# EAGLE schematic TA7642-AM (EAGLE 5.07)
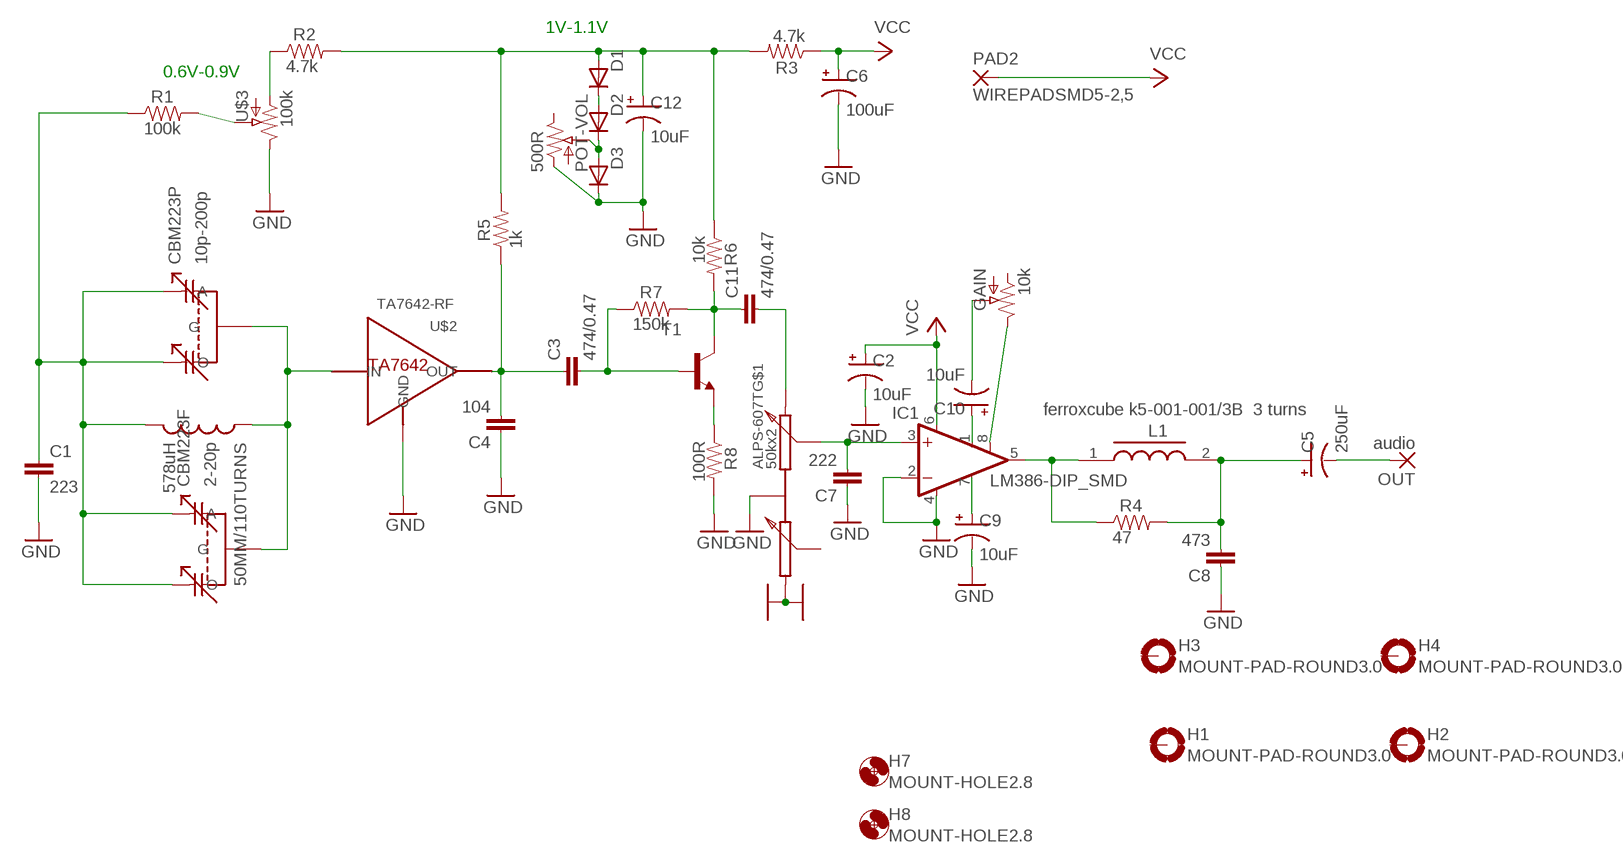
[diagram p0: schematic, sheet 1]

## Parts
50MM/110TURNS  578uH  INDUCTORPWR  [CDRH125]
ALPS-607T  50kx2  DUAL-POT-ALPS-607T-P  [ALPS-607T-PANEL]
C1  223  CAP-RF  [CAP-SMD-SMALL]
C2  10uF  CAP_POL-RF  [CPOL-SMD-10UF-25V]
C3  474/0.47  CAP-RF  [CAP-SMD-SMALL]
C4  104  CAP-RF  [CAP-SMD-SMALL]
C5  250uF  CAP_POL-RF  [CPOL-SMD-10UF-25V]
C6  100uF  CAP_POL-RF  [CPOL-SMD-10UF-25V]
C7  222  CAP-RF  [CAP-SMD-SMALL]
C8  473  CAP-RF  [CAP-SMD-SMALL]
C9  10uF  CAP_POL-RF  [CPOL-SMD-10UF-25V]
C10  10uF  CAP_POL-RF  [CPOL-SMD-10UF-25V]
C11  474/0.47  CAP-RF  [CAP-SMD-SMALL]
C12  10uF  CAP_POL-RF  [CPOL-SMD-10UF-25V]
CBM223F  2-20p  DUAL-TUNER-223P  [CBM-CAP]
CBM223P  10p-200p  DUAL-TUNER-223P  [CBM-CAP]
D1  DIODE1206  [1206-DIODE]
D2  DIODE1206  [1206-DIODE]
D3  DIODE1206  [1206-DIODE]
GAIN  10k  POTSMD_BW  [POT_SMD_BLUE_WHITE]
H1  MOUNT-PAD-ROUND3.0  [3,0-PAD]
H2  MOUNT-PAD-ROUND3.0  [3,0-PAD]
H3  MOUNT-PAD-ROUND3.0  [3,0-PAD]
H4  MOUNT-PAD-ROUND3.0  [3,0-PAD]
H7  MOUNT-HOLE2.8  [2,8]
H8  MOUNT-HOLE2.8  [2,8]
IC1  LM386-DIP_SMD  LM386-EXP  [DIP8-RF]
L1  ferroxcube k5-001-001/3B 3 turns  INDUCTOR-I-CDRH125  [CDRH125]
OUT  audio  WIREPADSMD5-2,5  [5-2,5]
PAD2  WIREPADSMD5-2,5  [5-2,5]
POT-VOL  500R  POTSMD_BW  [POT_SMD_BLUE_WHITE]
R1  100k  RESISTOR1/4W-RF  [AXIAL-0.3-SMD]
R2  4.7k  RESISTOR1/4W-RF  [AXIAL-0.3-SMD]
R3  4.7k  RESISTOR1/4W-RF  [AXIAL-0.3-SMD]
R4  47  RESISTOR1/4W-RF  [AXIAL-0.3-SMD]
R5  1k  RESISTOR1/4W-RF  [AXIAL-0.3-SMD]
R6  10k  RESISTOR1/4W-RF  [AXIAL-0.3-SMD]
R7  150k  RESISTOR1/4W-RF  [AXIAL-0.3-SMD]
R8  100R  RESISTOR1/4W-RF  [AXIAL-0.3-SMD]
T1  -NPN-TO92-EBC-SMD-MIRROR  [TO92-EBC-SMD-MIRROR]
U$2  TA7642-RF  [TA7642]
U$3  100k  POTSMD_BW  [POT_SMD_BLUE_WHITE]

## Nets
GND: ALPS-607T.C ALPS-607T.GND@1(GND@1:GND) ALPS-607T.GND@2(GND@2:GND) ALPS-607T.VIN2 C1.P$2 C2.- C4.P$1 C6.- C7.P$1 C8.P$1 C9.- C12.- D3.K(C) IC1.2(-IN) IC1.4(GND) POT-VOL.A R8.P$2 U$2.GND U$3.E
N$1: 50MM/110TURNS.1 CBM223F.G CBM223P.G U$2.IN
N$2: R2.P$1 U$3.A
N$3: R1.P$2 U$3.S
N$4: C3.P$1 C4.P$2 R5.P$1 U$2.OUT
N$5: 50MM/110TURNS.2 C1.P$1 CBM223F.A CBM223F.O CBM223P.A CBM223P.O R1.P$1
N$6: C11.P$1 R6.P$2 R7.P$2 T1.C
N$7: ALPS-607T.VIN1 C11.P$2
N$8: C5.+ C8.P$2 L1.2 R4.P$2
N$9: D1.K(C) D2.A
N$10: ALPS-607T.O1 C7.P$2 IC1.3(+IN)
N$11: C9.+ IC1.7(BYPASS)
N$12: IC1.5(OUT) L1.1 R4.P$1
N$14: C5.- OUT.1(P)
N$15: C10.+ IC1.1(GAIN)
N$16: C10.- GAIN.S
N$17: GAIN.E IC1.8(GAIN)
N$18: D2.K(C) D3.A POT-VOL.S
N$19: C3.P$2 R7.P$1 T1.B
N$22: R8.P$1 T1.E
N$23: C12.+ D1.A R2.P$2 R3.P$2 R5.P$2 R6.P$1
VCC: C2.+ C6.+ IC1.6(VS) PAD2.1(P) R3.P$1
Unconnected: ALPS-607T.O2 GAIN.A H1.B3,0(MOUNT) H2.B3,0(MOUNT) H3.B3,0(MOUNT) H4.B3,0(MOUNT) POT-VOL.E

## Notes on the sheet
- 1V-1.1V
- 0.6V-0.9V

## Library data of the parts
50MM/110TURNS = digital-toy:INDUCTOR: Inductors Basic Inductor/Choke - 0603 and 1206. Footprints are not proven and vary greatly between part numbers.
ALPS-607T = dtoy-RF:DUAL-POT: Dual POT for audio inital for alps 6mm shaft pot hyl, 2011/5/5 digital toy
C1 C3 C4 C7 C8 C11 = digital-toy:CAP: Capacitor Standard 0603 ceramic capacitor, and 0.1" leaded capacitor.
C2 C5 C6 C9 C10 C12 = digital-toy:CAP_POL: Capacitor Polarized These are standard SMD and PTH capacitors. Normally 10uF, 47uF, and 100uF in electrolytic and tantalum varieties. Always verify the external diameter of the through hole cap, it varies with capacity, voltage, and manufacturer. The EIA devices should be standard. PANASONIC_D size: 6.5mmx6.5mmx5.5mm, 100uf (taobao:6.3mmx5.5mm), same as CVL0605 153cvl0405 size: 4mmx4mmx5.5mm, 10uf (taobao:4mmx5.5mm) ct6032 typical 47uF Tantalum, comment by hyl.
CBM223F CBM223P = dtoy-RF:DUAL-TUNER
D1-D3 = digital-toy:DIODE: Diode These are standard reverse protection diodes and small signal diodes. SMA package can handle up to about 1A. SOD-323 can handle about 200mA. What the SOD-323 package when ordering, there are some mfgs out there that are 5-pin packages.
GAIN POT-VOL U$3 = digital-toy:POT: POT digital toy POT, 3296 multi turn, blue-white ... hyl 8/07/2001
H1-H4 = holes:MOUNT-PAD-ROUND: MOUNTING PAD, round
H7 H8 = holes:MOUNT-HOLE: MOUNTING HOLE with drill center marker
IC1 = digital-toy:LM386
L1 = digital-toy:INDUCTOR-I: Inductors with Iron
OUT PAD2 = wirepad:WIREPAD: Wire PAD connect wire on PCB
R1-R8 = digital-toy:RESISTOR: Resistor Basic schematic elements and footprints for 0603, 1206, and PTH 1/10th watt (small) resistors. digital-toy copy vertical mount of axial-0.3 from rcl.lbr : the 0207/xx 3W resistor: 0617/17, 0617/22, 0617V
T1 = digital-toy:*-NPN-: NPN Transistror most of sot-23 use the pacages sot23-BEC, top C, left B, right E. by hyl, digital-toy. and to-92 use ebc(from-top) by hyl, digital-toy.
U$2 = dtoy-RF:TA7642